# Altium schematic sheet CY8C4125AZI-S433.SchDoc: CY8C4125AZI-S433
size A3
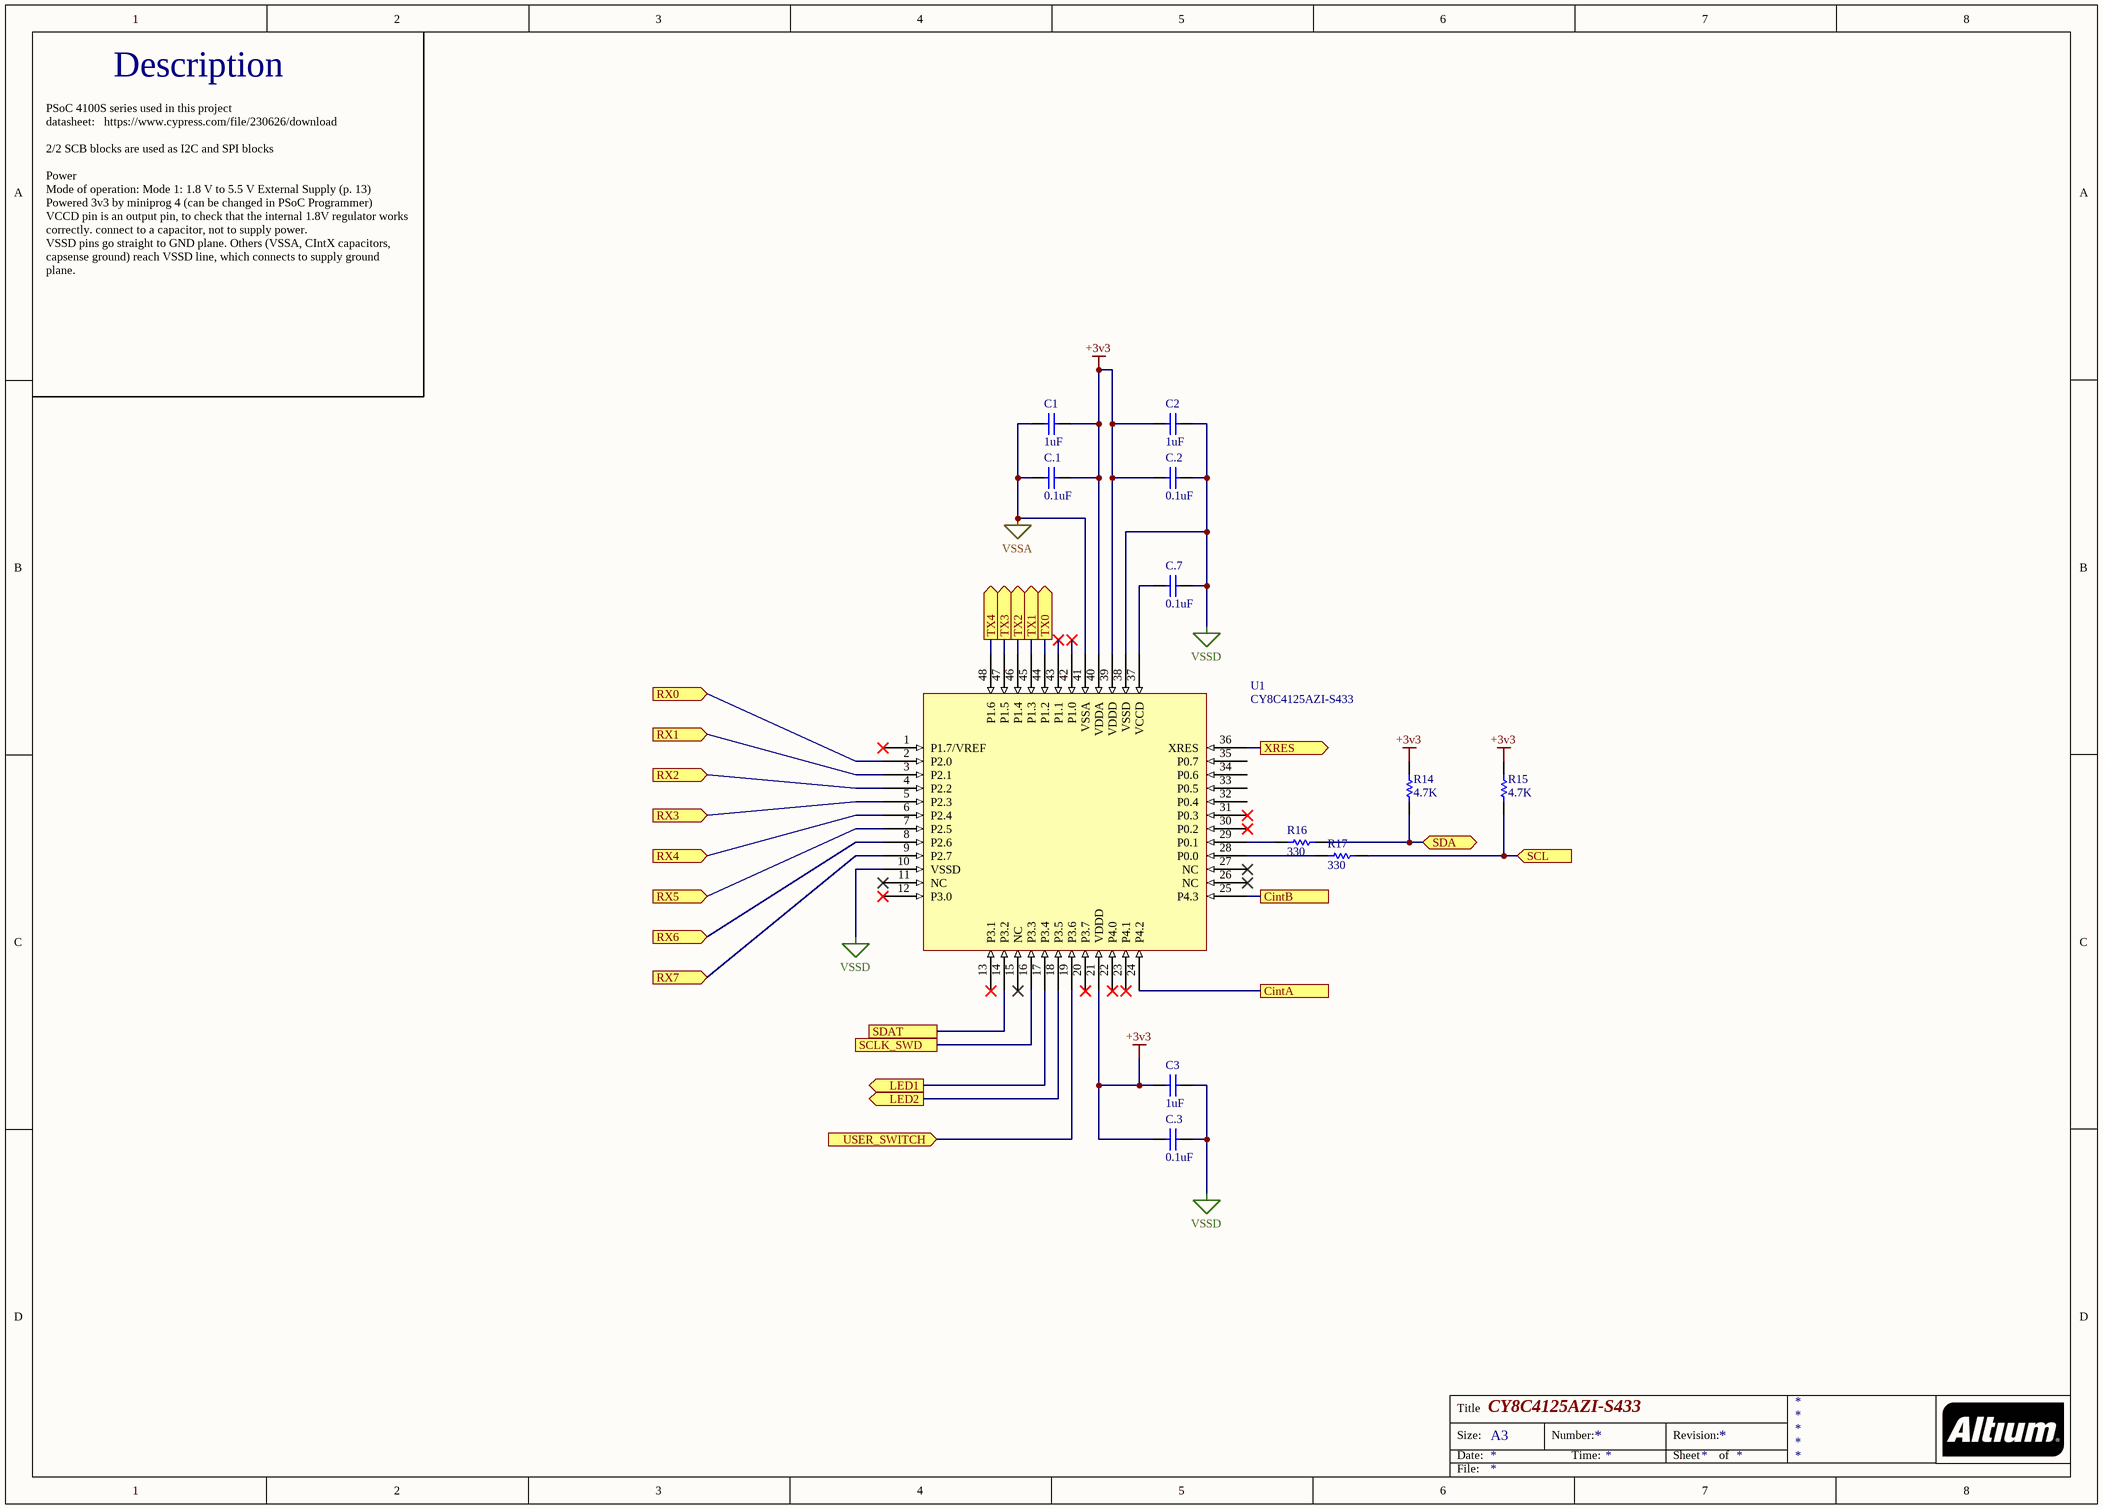
[diagram p0: CY8C4125AZI-S433.SchDoc]

## Parts
C1  1uF  [CAPC0603(1608)100_N]
C2  1uF  [CAPC0603(1608)100_N]
C3  1uF  [CAPC0603(1608)100_N]
C.1  0.1uF  [CAPC0603(1608)100_N]
C.2  0.1uF  [CAPC0603(1608)100_N]
C.3  0.1uF  [CAPC0603(1608)100_N]
C.7  0.1uF  [CAPC0603(1608)100_N]
R14  4.7K  [RESC1608X55X25ML10T15]
R15  4.7K  [RESC1608X55X25ML10T15]
R16  330  [RESC0603(1608)_L]
R17  330  [RESC0603(1608)_L]
U1  CY8C4125AZI-S433  [CY8C4125AZI-S433]

## Ports
CintA, CintB, LED1 (out), LED2 (out), RX0 (in), RX1 (in), RX2 (in), RX3 (in), RX4 (in), RX5 (in), RX6 (in), RX7 (in), SCL (in), SCLK_SWD, SDA (bidir), SDAT, TX0 (out), TX1 (out), TX2 (out), TX3 (out), TX4 (out), USER_SWITCH (in), XRES (out)

## Nets
+3v3: C1.2 C2.1 C3.1 C.1.2 C.2.1 C.3.1 R14.2 R15.2 U1.21(VDDD) U1.39(VDDD) U1.40(VDDA)
VSSA: C1.1 C.1.1 U1.41(VSSA)
VSSD: C2.2 C3.2 C.2.2 C.3.2 C.7.2 U1.10(VSSD) U1.38(VSSD)
CintA: U1.24(P4.2) ; port CintA
CintB: U1.25(P4.3) ; port CintB
LED1: U1.17(P3.4) ; port LED1
LED2: U1.18(P3.5) ; port LED2
RX0: U1.2(P2.0) ; port RX0
RX1: U1.3(P2.1) ; port RX1
RX2: U1.4(P2.2) ; port RX2
RX3: U1.5(P2.3) ; port RX3
RX4: U1.6(P2.4) ; port RX4
RX5: U1.7(P2.5) ; port RX5
RX6: U1.8(P2.6) ; port RX6
RX7: U1.9(P2.7) ; port RX7
SCL: R15.1 R17.2 ; port SCL
SCLK_SWD: U1.16(P3.3) ; port SCLK_SWD
SDA: R14.1 R16.2 ; port SDA
SDAT: U1.14(P3.2) ; port SDAT
TX0: U1.44(P1.2) ; port TX0
TX1: U1.45(P1.3) ; port TX1
TX2: U1.46(P1.4) ; port TX2
TX3: U1.47(P1.5) ; port TX3
TX4: U1.48(P1.6) ; port TX4
USER_SWITCH: U1.19(P3.6) ; port USER_SWITCH
XRES: U1.36(XRES) ; port XRES
NetC.7_1: C.7.1 U1.37(VCCD)
NetR16_1: R16.1 U1.29(P0.1)
NetR17_1: R17.1 U1.28(P0.0)

Not connected (* = marked no-connect by the designer): U1 1(P1.7/VREF)* 11(NC)* 12(P3.0)* 13(P3.1)* 15(NC)* 20(P3.7)* 22(P4.0)* 23(P4.1)* 26(NC)* 27(NC)* 30(P0.2)* 31(P0.3)* 32(P0.4) 33(P0.5) 34(P0.6) 35(P0.7) 42(P1.0)* 43(P1.1)*

## Notes on the sheet
- Description
- PSoC 4100S series used in this project
  datasheet:   https://www.cypress.com/file/230626/download
  2/2 SCB blocks are used as I2C and SPI blocks
  Power
  Mode of operation: Mode 1: 1.8 V to 5.5 V External Supply (p. 13)
  Powered 3v3 by miniprog 4 (can be changed in PSoC Programmer)
  VCCD pin is an output pin, to check that the internal 1.8V regulator works correctly. connect to a capacitor, not to supply power.
  VSSD pins go straight to GND plane. Others (VSSA, CIntX capacitors, capsense ground) reach VSSD line, which connects to supply ground plane.
- Title
- Size:
- Date:
- A3
- Number:
- Time:
- Revision:
- Sheet
- of
- File:

## Library data of the parts
C1-C3 = CMP-1035-02746-1: CAP 1uF 50V ±20% 0603 (1608 Metric) Thickness 1mm SMD; Tolerance: Â±20%; Case-EIA: 0603; Case-Metric: 1608; Value: 1uF; Technology: SMT; Max Thickness: 1 mm; Rated Voltage: 50 V
C.1-C.3 C.7 = CMP-1035-02746-1: CAP 0.1 uF 50V ±20% 0603 (1608 Metric) Thickness 1mm SMD; Tolerance: Â±20%; Value: 1uF; Case-EIA: 0603; Case-Metric: 1608; Technology: SMT; Max Thickness: 1 mm; Rated Voltage: 50 V
R14 R15 = CMP-2000-05024-1: RC0603JR-074K7L Chip Resistor, 4.7 KOhm, +/- 5%, 100 mW, -55 to 155 degC, 0603 (1608 Metric), RoHS, Tape and Reel; Manufacturer: Yageo; Resistance: 4.7kOhms; Temperature Coefficient: 100PPM/C; Power Rating: 100mW; Voltage Rating: 50V; Operating Temperature Range: -55Cto+155C; Case Code - mm: 1608; Tolerance: 5%; Product: ThickFilmResistorsGeneralPurpose; Case Code - in: 0603; Datasheet URL: http://www.yageo.com/documents/recent/PYu-RC_Group_51_RoHS_L_04.pdf; Package Reference: 603; Datasheet Version: Rev. 4, 02/2016; Package Description: 2-Pin Surface Mount Device, Body 1.6 x 0.8 mm; Manufacturer URL: http://www.yageo.com/; Series: RC; Packaging: Reel; Termination Style: SMD/SMT
R16 R17 = CMP-1012-00062-1: 330R 0.1W 5% 0603 (1608 Metric)  SMD; Value: 330.00 Ohm; Case-EIA: 0603; Case-Metric: 1608; Tolerance: 5 %; Power: 0.1 W; Technology: SMT